# Altium schematic sheet Graviton-Top.SchDoc: Graviton - Main
size Legal; CheckedBy: J. Brinton; CompanyName: Signal Laboratories, Inc.; DrawnBy: J. Brinton; Engineer: J. Brinton; Address1: 3479 Edison Way; Address2: Menlo Park CA 94025; Address3: +1 (877) 778-8435; Address4: siglabs.com; DocumentNumber: 1; Revision: 2b; SheetNumber: 1; SheetTotal: 58
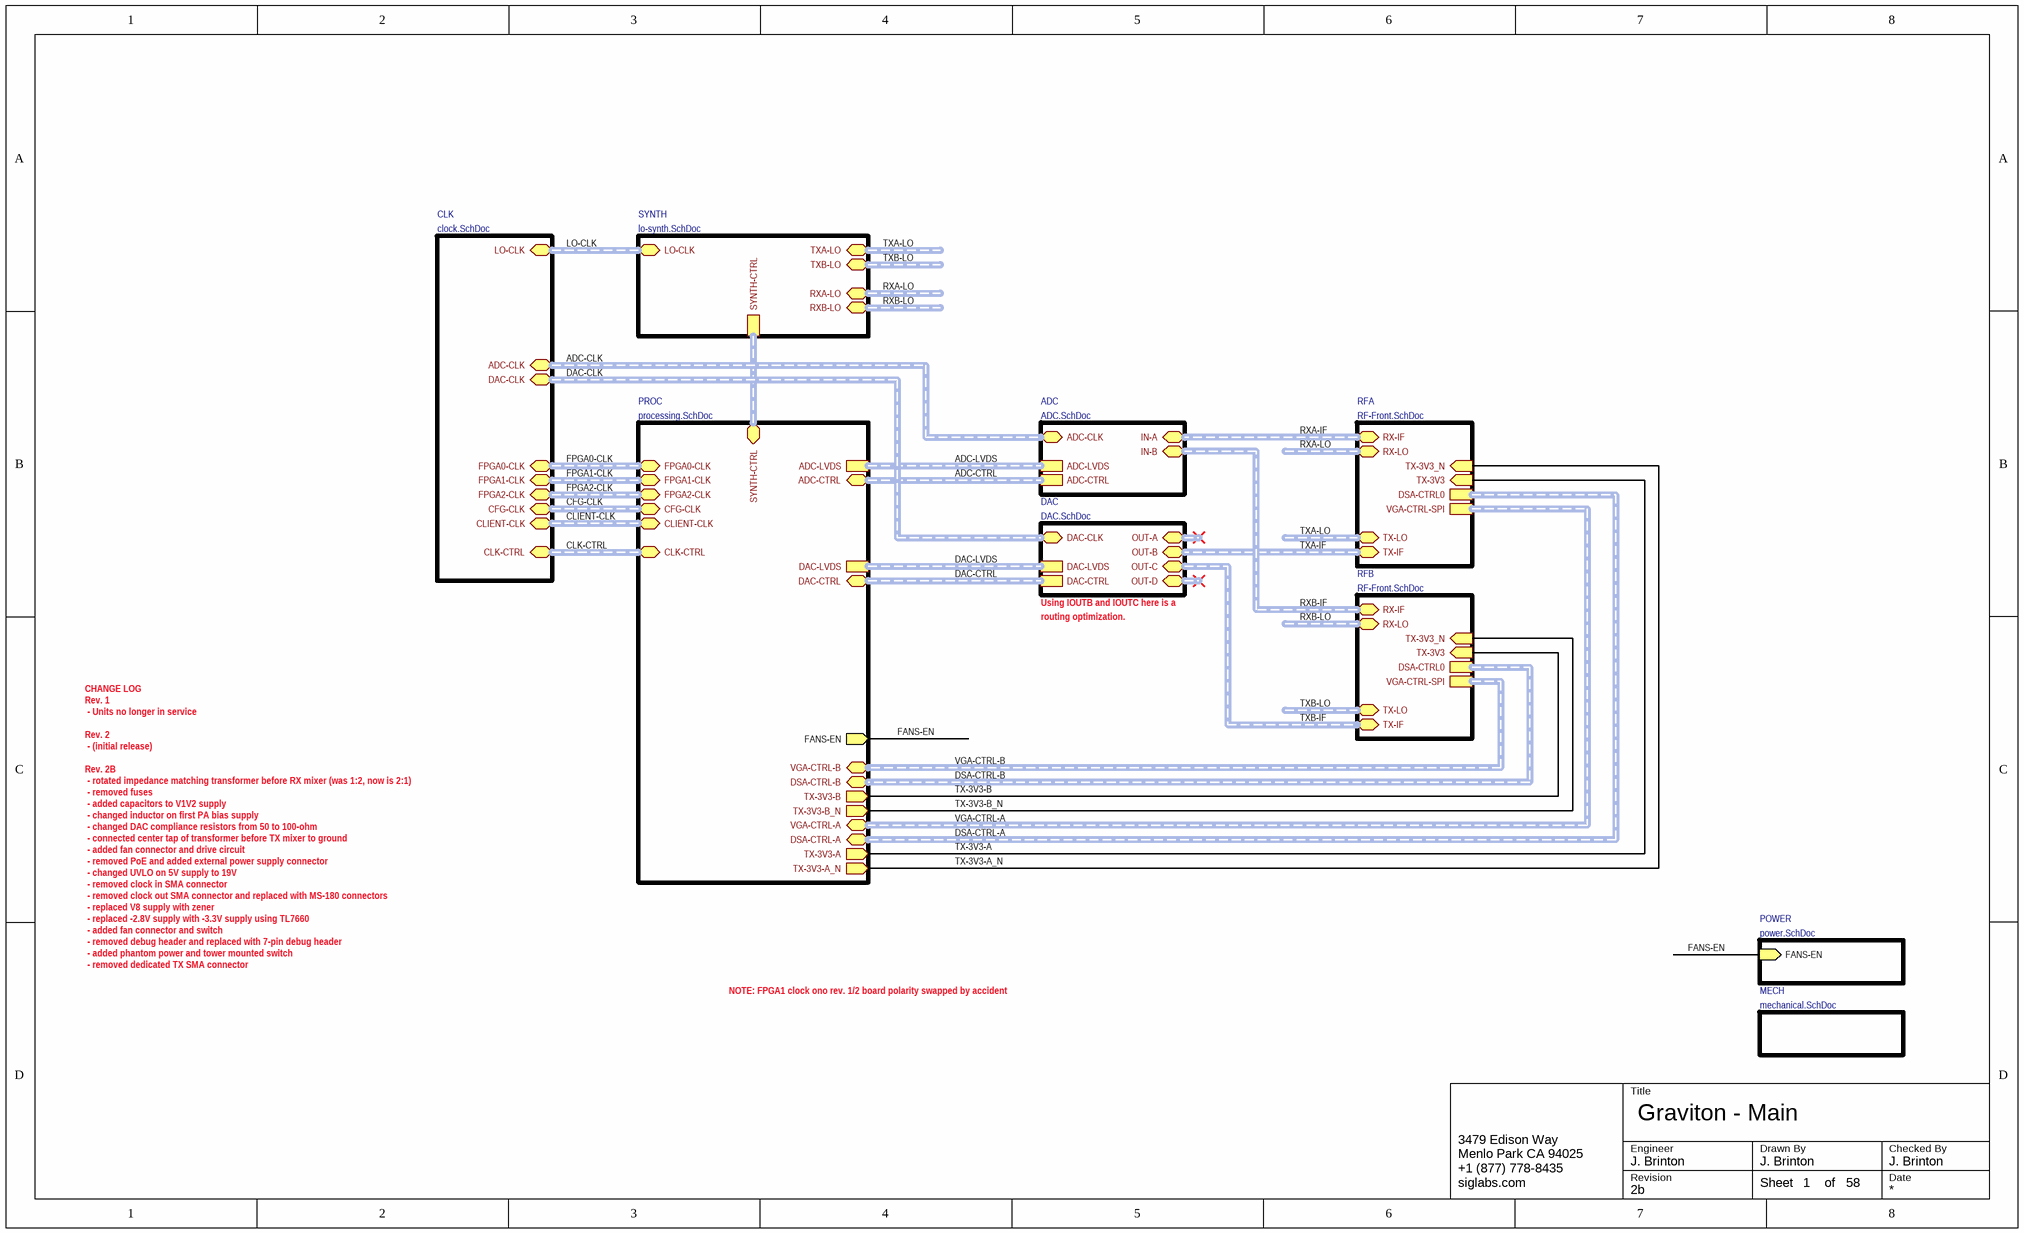
[diagram p0: Graviton-Top.SchDoc]

## Sub-sheets
ADC = ADC.SchDoc: ADC-LVDS (harness ADC-LVDS), ADC-CTRL (harness ADC-CTRL-1V8), ADC-CLK (harness CLK-LVPECL33-TERM), IN-B (harness DIFF100), IN-A (harness DIFF100)
CLK = clock.SchDoc: CLK-CTRL (harness CLK-CTRL), CLIENT-CLK (harness CLK-LVPECL33), ADC-CLK (harness CLK-LVPECL33-TERM), CFG-CLK (harness CLK-LVPECL33), FPGA2-CLK (harness CLK-LVPECL33), FPGA0-CLK (harness CLK-LVPECL33), LO-CLK (harness CLK-LVPECL33), FPGA1-CLK (harness CLK-LVPECL33), DAC-CLK (harness CLK-LVPECL33-TERM)
DAC = DAC.SchDoc: DAC-CTRL (harness DAC-CTRL), DAC-LVDS (harness DAC-LVDS), OUT-A (harness DIFF100), OUT-B (harness DIFF100), OUT-C (harness DIFF100), OUT-D (harness DIFF100), DAC-CLK (harness CLK-LVPECL33-TERM)
MECH = mechanical.SchDoc: no entries
POWER = power.SchDoc: FANS-EN (in)
PROC = processing.SchDoc: DAC-LVDS (harness DAC-LVDS), ADC-LVDS (harness ADC-LVDS), TX-3V3-A (out), DSA-CTRL-B (harness DSA_CTRL), DSA-CTRL-A (harness DSA_CTRL), VGA-CTRL-B (harness SPI), VGA-CTRL-A (harness SPI), DAC-CTRL (harness DAC-CTRL), SYNTH-CTRL (harness SYNTH-CTRL), CLK-CTRL (harness CLK-CTRL), ADC-CTRL (harness ADC-CTRL-1V8), TX-3V3-B (out), FPGA0-CLK (harness CLK-LVPECL33), CLIENT-CLK (harness CLK-LVPECL33), FPGA1-CLK (harness CLK-LVPECL33), FPGA2-CLK (harness CLK-LVPECL33), CFG-CLK (harness CLK-LVPECL33), FANS-EN (out), TX-3V3-B_N (out), TX-3V3-A_N (out)
RFA = RF-Front.SchDoc: DSA-CTRL0 (harness DSA_CTRL), VGA-CTRL-SPI (harness SPI), TX-3V3 (in), TX-LO (harness CLK-LVPECL33), RX-LO (harness CLK-LVDS), TX-IF (harness DIFF100), RX-IF (harness DIFF100), TX-3V3_N (in)
RFB = RF-Front.SchDoc: DSA-CTRL0 (harness DSA_CTRL), VGA-CTRL-SPI (harness SPI), TX-3V3 (in), TX-LO (harness CLK-LVPECL33), RX-LO (harness CLK-LVDS), TX-IF (harness DIFF100), RX-IF (harness DIFF100), TX-3V3_N (in)
SYNTH = lo-synth.SchDoc: SYNTH-CTRL (harness SYNTH-CTRL), LO-CLK (harness CLK-LVPECL33), TXA-LO (harness CLK-LVPECL33), RXA-LO (harness CLK-LVDS), RXB-LO (harness CLK-LVDS), TXB-LO (harness CLK-LVPECL33)

## Nets
FANS-EN: sheet POWER/FANS-EN, sheet PROC/FANS-EN
TX-3V3-A: sheet PROC/TX-3V3-A, sheet RFA/TX-3V3
TX-3V3-A_N: sheet PROC/TX-3V3-A_N, sheet RFA/TX-3V3_N
TX-3V3-B: sheet PROC/TX-3V3-B, sheet RFB/TX-3V3
TX-3V3-B_N: sheet PROC/TX-3V3-B_N, sheet RFB/TX-3V3_N

## Buses and harness runs
harness ADC-CLK = sheet ADC/ADC-CLK = sheet CLK/ADC-CLK
harness ADC-CTRL = sheet ADC/ADC-CTRL = sheet PROC/ADC-CTRL
harness ADC-LVDS = sheet ADC/ADC-LVDS = sheet PROC/ADC-LVDS
harness CFG-CLK = sheet CLK/CFG-CLK = sheet PROC/CFG-CLK
harness CLIENT-CLK = sheet CLK/CLIENT-CLK = sheet PROC/CLIENT-CLK
harness CLK-CTRL = sheet CLK/CLK-CTRL = sheet PROC/CLK-CTRL
harness DAC-CLK = sheet CLK/DAC-CLK = sheet DAC/DAC-CLK
harness DAC-CTRL = sheet DAC/DAC-CTRL = sheet PROC/DAC-CTRL
harness DAC-LVDS = sheet DAC/DAC-LVDS = sheet PROC/DAC-LVDS
harness DSA-CTRL-A = sheet PROC/DSA-CTRL-A = sheet RFA/DSA-CTRL0
harness DSA-CTRL-B = sheet PROC/DSA-CTRL-B = sheet RFB/DSA-CTRL0
harness FPGA0-CLK = sheet CLK/FPGA0-CLK = sheet PROC/FPGA0-CLK
harness FPGA1-CLK = sheet CLK/FPGA1-CLK = sheet PROC/FPGA1-CLK
harness FPGA2-CLK = sheet CLK/FPGA2-CLK = sheet PROC/FPGA2-CLK
harness LO-CLK = sheet CLK/LO-CLK = sheet SYNTH/LO-CLK
harness RXA-IF = sheet ADC/IN-A = sheet RFA/RX-IF
harness RXA-LO = sheet RFA/RX-LO
harness RXA-LO = sheet SYNTH/RXA-LO
harness RXB-IF = sheet ADC/IN-B = sheet RFB/RX-IF
harness RXB-LO = sheet RFB/RX-LO
harness RXB-LO = sheet SYNTH/RXB-LO
harness sheet PROC/SYNTH-CTRL = sheet SYNTH/SYNTH-CTRL
harness TXA-IF = sheet DAC/OUT-B = sheet RFA/TX-IF
harness TXA-LO = sheet RFA/TX-LO
harness TXA-LO = sheet SYNTH/TXA-LO
harness TXB-IF = sheet DAC/OUT-C = sheet RFB/TX-IF
harness TXB-LO = sheet RFB/TX-LO
harness TXB-LO = sheet SYNTH/TXB-LO
harness VGA-CTRL-A = sheet PROC/VGA-CTRL-A = sheet RFA/VGA-CTRL-SPI
harness VGA-CTRL-B = sheet PROC/VGA-CTRL-B = sheet RFB/VGA-CTRL-SPI

## Notes on the sheet
- Using IOUTB and IOUTC here is a
- routing optimization.
- NOTE: FPGA1 clock ono rev. 1/2 board polarity swapped by accident
- CHANGE LOG
  Rev. 1
  - Units no longer in service
  Rev. 2
  - (initial release)
  Rev. 2B
  - rotated impedance matching transformer before RX mixer (was 1:2, now is 2:1)
  - removed fuses
  - added capacitors to V1V2 supply
  - changed inductor on first PA bias supply
  - changed DAC compliance resistors from 50 to 100-ohm
  - connected center tap of transformer before TX mixer to ground
  - added fan connector and drive circuit
  - removed PoE and added external power supply connector
  - changed UVLO on 5V supply to 19V
  - removed clock in SMA connector
  - removed clock out SMA connector and replaced with MS-180 connectors
  - replaced V8 supply with zener
  - replaced -2.8V supply with -3.3V supply using TL7660
  - added fan connector and switch
  - removed debug header and replaced with 7-pin debug header
  - added phantom power and tower mounted switch
  - removed dedicated TX SMA connector
- Title
- Engineer
- Revision
- Drawn By
- Checked By
- Date
- Sheet
- of